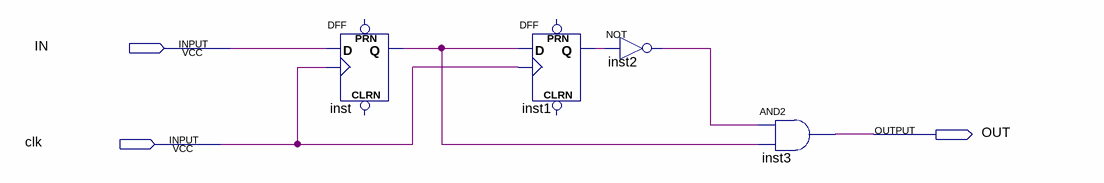
[diagram p0: schematic sheet]
// Quartus schematic deb.bdf as structural Verilog: 4 symbols, 3 pins
module deb (
  input  IN,
  input  clk,
  output OUT
);

  wire inst1_q, inst2_out, inst_q;

  DFF inst (.CLK(clk), .D(IN), .Q(inst_q));  // open: CLRN, PRN
  DFF inst1 (.CLK(clk), .D(inst_q), .Q(inst1_q));  // open: CLRN, PRN
  not inst2 (inst2_out, inst1_q);
  and inst3 (OUT, inst2_out, inst_q);
endmodule
